# Altium schematic sheet MOTOR_MAQUINA.SchDoc
size A4; SheetNumber: 1; SheetTotal: 1
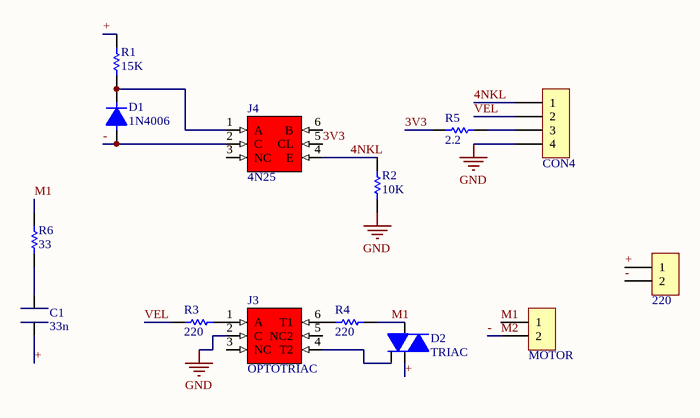
[diagram p0: MOTOR_MAQUINA.SchDoc]

## Parts
C1  33n  [CAP300]
D1  1N4006  [DO41]
D2  TRIAC  [TO-220 V]
J1  MOTOR  [BORNERA2]
J2  220  [BORNERA2]
J3  OPTOTRIAC  [DIP6]
J4  4N25  [DIP6]
J5  CON4  [SIP4]
R1  15K  [R Axial 0.8]
R2  10K  [0805]
R3  220  [0805]
R4  220  [0805]
R5  2.2  [0805]
R6  33  [R Axial 0.8]

## Nets
GND: J3.2(C) J5.4 R2.1
3V3: J4.5(CL) R5.2
4NKL: J4.4(E) J5.1 R2.2
+: C1.2 D2.1 J2.1 R1.1
-: D1.1 J1.2 J2.2 J4.2(C)  [also labelled M2]
M1: D2.2 J1.1 R4.1 R6.2
VEL: J5.2 R3.2
NetC1_1: C1.1 R6.1
NetD1_2: D1.2 J4.1(A) R1.2
NetD2_3: D2.3 J3.4(T2)
NetJ3_1: J3.1(A) R3.1
NetJ3_6: J3.6(T1) R4.2
NetJ5_3: J5.3 R5.1

Not connected (* = marked no-connect by the designer): J3 3(NC) 5(NC2); J4 3(NC) 6(B)

## Library data of the parts
C1 = CAP: Autor: Brula, Tomas; Fecha: 19/4/22
D1 = DIODO
J1 J2 = BORNERA 2
R1-R6 = RES